# EAGLE schematic board with arduinomicr3 (EAGLE 7.5.0)
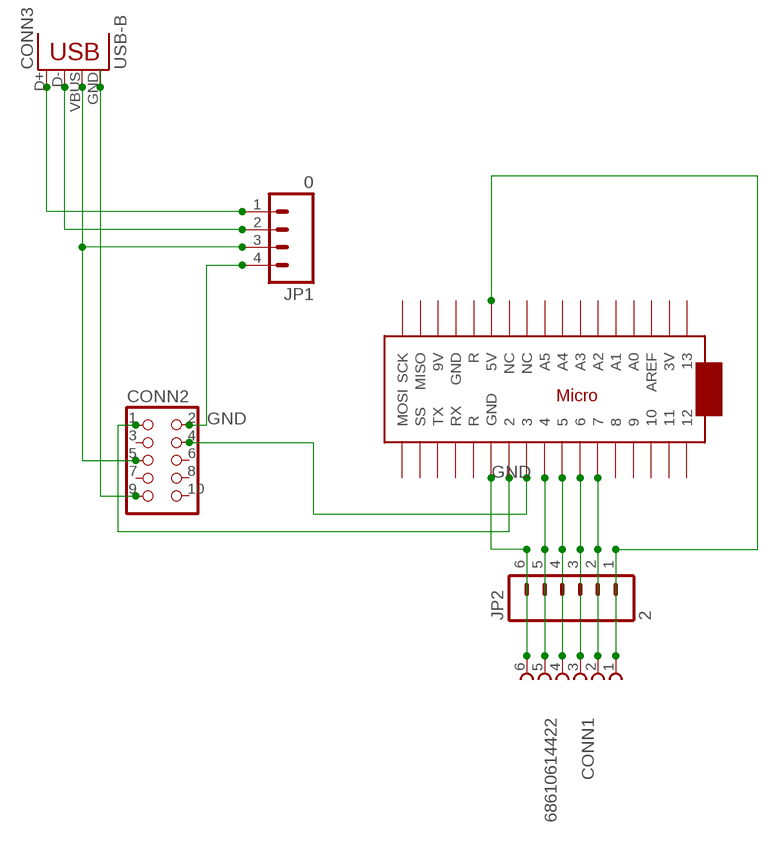
[diagram p0: schematic, sheet 1]

## Parts
CONN1  68610614422  [68610614422]
CONN2  CON_HEADER_2X05-PTH+SHROUDED_A  [PINSHRD_PTH_2X05]
CONN3  USB-B  USBPTH  [USB-B-PTH]
JP1  0  M04LONGPADS  [1X04_LONGPADS]
JP2  2  M06LOCK_LONGPADS  [1X06_LOCK_LONGPADS]
U$1  ARDUINOMICRO  [ARDUINOMICRO]

## Nets
0V: CONN2.9 CONN3.GND
5V: CONN1.1 JP2.1 U$1.P$23(5V)
CLK: CONN1.5 JP2.5 U$1.P$9
D+: CONN3.D+ JP1.1
D-: CONN3.D- JP1.2
GND: CONN1.6 CONN2.2 JP1.4 JP2.6 U$1.P$21(GND)
GREEN: CONN2.1 U$1.P$11
OUT: CONN1.4 JP2.4 U$1.P$8
RED: CONN2.4 U$1.P$10
SHIFT: CONN1.3 JP2.3 U$1.P$7
TEST: CONN1.2 JP2.2 U$1.P$6
V+: CONN2.5 CONN3.VBUS JP1.3
Unconnected: CONN2.3 CONN2.6 CONN2.7 CONN2.8 CONN2.10 U$1.P$1 U$1.P$2 U$1.P$3 U$1.P$4 U$1.P$5 U$1.P$12(GND) U$1.P$13(R) U$1.P$14(RX) U$1.P$15(TX) U$1.P$16(SS) U$1.P$17(MOSI) U$1.P$18(SCK) U$1.P$19(MISO) U$1.P$20(9V) U$1.P$22(R) U$1.P$24(NC) U$1.P$25(NC) U$1.P$26(A5) U$1.P$27(A4) U$1.P$28(A3) U$1.P$29(A2) U$1.P$30(A1) U$1.P$31(A0) U$1.P$32(AREF) U$1.P$33(3V) U$1.P$34

## Library data of the parts
CONN1 = Wurth_Elektronik_Electromechanic_FPC_Connectors_&_Flat_Flexible_Cable_rev15b:68610614422: WR-FPC 1.00mm SMT ZIF Horizontal Bottom Contact, 6 Pins=>Code : Con_FPC_ZIF_1.00_68610614422 <http://katalog.we-online.de/media/images/eican/Con_FPC_ZIF_1.00_6861xx14422_pf2.jpg> Details see: http://katalog.we-online.de/en/em/686_1xx_144_22 Created 2014-07-09, Karrer Zheng 2014 (C) Würth Elektronik
CONN2 = dp_devices:CON_HEADER_2X05: 2x05 pin header
CONN3 = SparkFun-Connectors:USB: USB Connectors USB-B-PTH is fully proven SKU : PRT-00139/CONN-08278 USB-miniB is fully proven SKU : PRT-00587 USB-A-PCB is untested. USB-A-H is throughly reviewed, but untested. Spark Fun Electronics SKU : PRT-00437 USB-B-SMT is throughly reviewed, but untested. Needs silkscreen touching up. USB-A-S has not been used/tested USB-MB-H has not been used/tested USB-MICROB has been used. CONN-09505; PROD_ID: CONN-08278
JP1 = SparkFun-Connectors:M04: Header 4 Standard 4-pin 0.1" header. Use with straight break away headers (SKU : PRT-00116), right angle break away headers (PRT-00553), swiss pins (PRT-00743), machine pins (PRT-00117), and female headers (PRT-00115). Molex polarized connector foot print use with SKU : PRT-08231 with associated crimp pins and housings. 1MM SMD Version SKU: PRT-10208
JP2 = SparkFun-Connectors:M06: Header 6 Standard 6-pin 0.1" header. Use with straight break away headers (SKU : PRT-00116), right angle break away headers (PRT-00553), swiss pins (PRT-00743), machine pins (PRT-00117), and female headers (PRT-00115). Molex polarized connector foot print use with SKU : PRT-08094 with associated crimp pins and housings. NOTES ON THE VARIANTS LOCK and LOCK_LONGPADS... This footprint was designed to help hold the alignment of a through-hole component (i.e. 6-pin header) while soldering it into place. You may notice that each hole has been shifted either up or down by 0.005 of an inch from it's more standard position (which is a perfectly straight line). This slight alteration caused the pins (the squares in the middle) to touch the edges of the holes. Because they are alternating, it causes a "brace" to hold the component in place. 0.005 has proven to be the perfect amount of "off-center" position when using our standard breakaway headers. Although looks a little odd when you look at the bare footprint, once you have a header in there, the alteration is very hard to notice. Also,if you push a header all the way into place, it is covered up entirely on the bottom side. This idea of altering the position of holes to aid alignment will be further integrated into the Sparkfun Library for other footprints. It can help hold any component with 3 or more connection pins.
U$1 = adafruit:ARDUINOMICRO

## Net classes
0 default: width 0.305 mm, drill 0.508 mm, clearance 0.254 mm